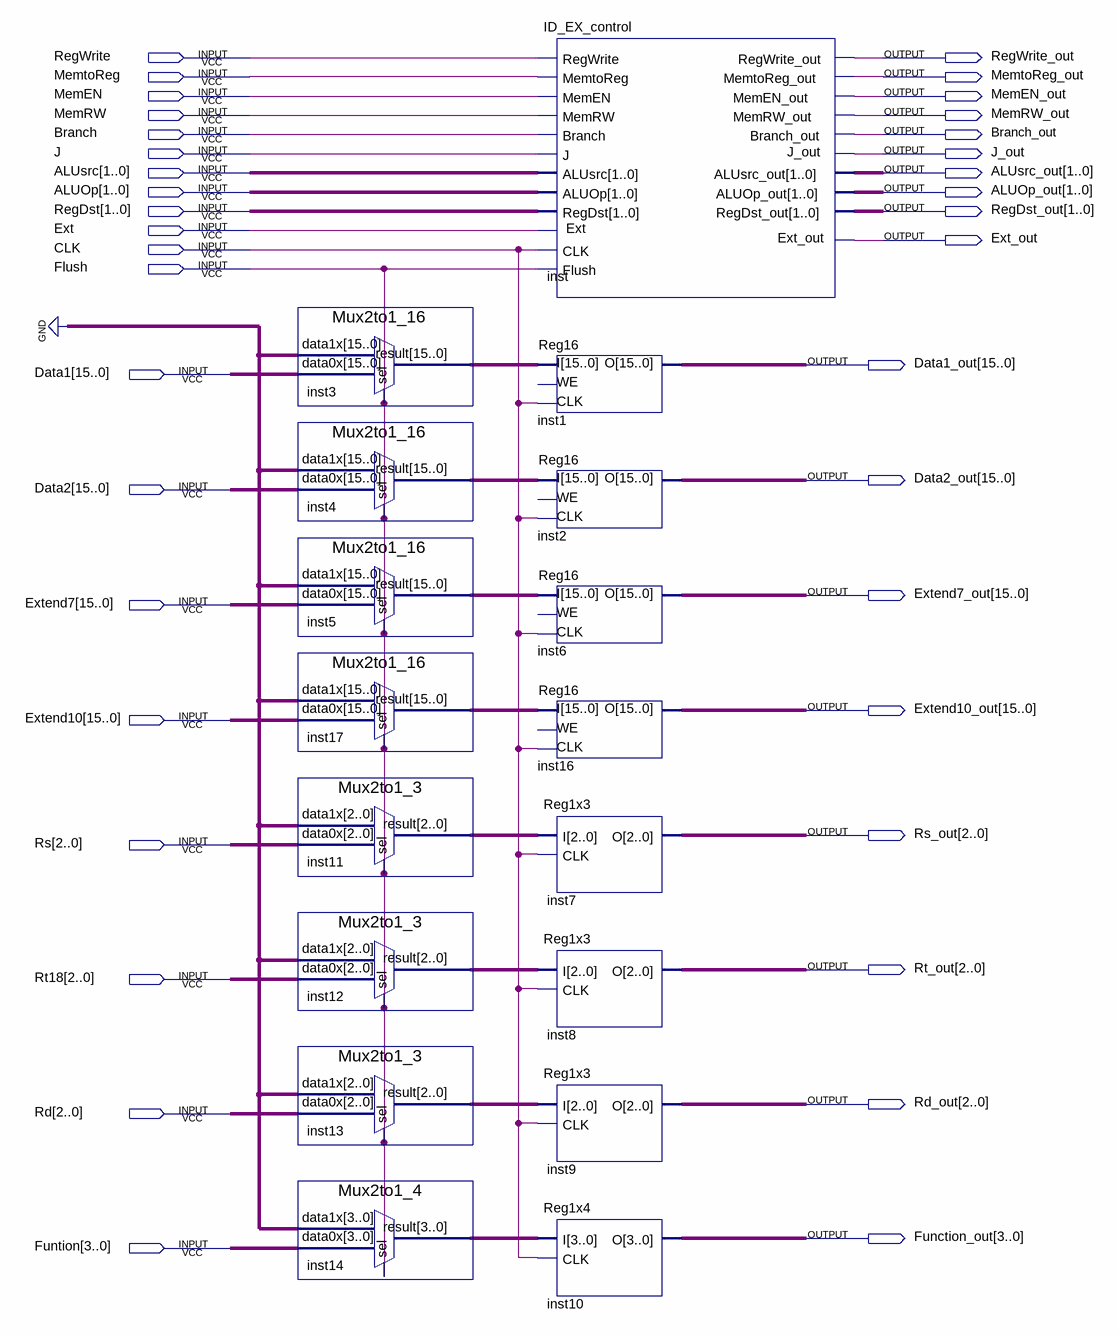
[diagram p0: schematic sheet]
// Quartus schematic ID_EX.bdf as structural Verilog: 17 symbols, 38 pins
module ID_EX (
  input  RegWrite,
  input  MemtoReg,
  input  MemEN,
  input  MemRW,
  input  Branch,
  input  J,
  input  [1:0] ALUsrc,
  input  [1:0] ALUOp,
  input  [1:0] RegDst,
  input  Ext,
  input  CLK,
  input  Flush,
  input  [15:0] Data1,
  input  [15:0] Data2,
  input  [15:0] Extend7,
  input  [15:0] Extend10,
  input  [2:0] Rs,
  input  [2:0] Rt18,
  input  [2:0] Rd,
  input  [3:0] Funtion,
  output RegWrite_out,
  output MemtoReg_out,
  output MemEN_out,
  output MemRW_out,
  output Branch_out,
  output J_out,
  output [1:0] ALUsrc_out,
  output [1:0] ALUOp_out,
  output [1:0] RegDst_out,
  output Ext_out,
  output [15:0] Data1_out,
  output [15:0] Data2_out,
  output [15:0] Extend7_out,
  output [15:0] Extend10_out,
  output [2:0] Rs_out,
  output [2:0] Rt_out,
  output [2:0] Rd_out,
  output [3:0] Function_out
);

  wire [2:0] inst11_result, inst12_result, inst13_result;
  wire [3:0] inst14_result;
  wire [15:0] inst3_result, inst4_result, inst5_result, inst17_result;

  Mux2to1_16 inst3 (.data1x({16{1'b0}}), .data0x(Data1), .sel(Flush), .result(inst3_result));
  Mux2to1_16 inst4 (.data1x({16{1'b0}}), .data0x(Data2), .sel(Flush), .result(inst4_result));
  Mux2to1_16 inst5 (.data1x({16{1'b0}}), .data0x(Extend7), .sel(Flush), .result(inst5_result));
  Mux2to1_16 inst17 (.data1x({16{1'b0}}), .data0x(Extend10), .sel(Flush), .result(inst17_result));
  Mux2to1_3 inst11 (.data1x({16{1'b0}}), .data0x(Rs), .sel(Flush), .result(inst11_result));
  Mux2to1_3 inst12 (.data1x({16{1'b0}}), .data0x(Rt18), .sel(Flush), .result(inst12_result));
  Mux2to1_3 inst13 (.data1x({16{1'b0}}), .data0x(Rd), .sel(Flush), .result(inst13_result));
  Mux2to1_4 inst14 (.data1x({16{1'b0}}), .data0x(Funtion), .sel(Flush), .result(inst14_result));
  ID_EX_control inst (
    .Flush(Flush), .RegDst(RegDst), .RegWrite(RegWrite), .ALUsrc(ALUsrc), .Branch(Branch), .ALUOp(ALUOp),
    .CLK(CLK), .J(J), .Ext(Ext), .MemEN(MemEN), .MemRW(MemRW), .MemtoReg(MemtoReg), .RegDst_out(RegDst_out),
    .RegWrite_out(RegWrite_out), .ALUsrc_out(ALUsrc_out), .Branch_out(Branch_out), .ALUOp_out(ALUOp_out),
    .J_out(J_out), .Ext_out(Ext_out), .MemEN_out(MemEN_out), .MemRW_out(MemRW_out),
    .MemtoReg_out(MemtoReg_out));
  Reg16 inst1 (.CLK(CLK), .I(inst3_result), .O(Data1_out));  // open: WE
  Reg16 inst2 (.CLK(CLK), .I(inst4_result), .O(Data2_out));  // open: WE
  Reg16 inst6 (.CLK(CLK), .I(inst5_result), .O(Extend7_out));  // open: WE
  Reg16 inst16 (.CLK(CLK), .I(inst17_result), .O(Extend10_out));  // open: WE
  Reg1x3 inst7 (.I(inst11_result), .CLK(CLK), .O(Rs_out));
  Reg1x3 inst8 (.I(inst12_result), .CLK(CLK), .O(Rt_out));
  Reg1x3 inst9 (.I(inst13_result), .CLK(CLK), .O(Rd_out));
  Reg1x4 inst10 (.I(inst14_result), .CLK(CLK), .O(Function_out));
endmodule
